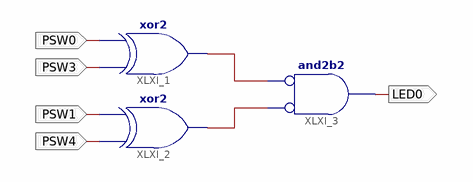
[diagram p0: schematic sheet 1]
// Xilinx ISE schematic lab5_1_comparator.sch (spartan3) as structural Verilog: 3 symbols, 5 ports
module lab5_1_comparator (
  input  PSW0,
  input  PSW3,
  input  PSW1,
  input  PSW4,
  output LED0
);

  wire XLXN_1, XLXN_2;

  xor XLXI_1 (XLXN_1, PSW3, PSW0);
  xor XLXI_2 (XLXN_2, PSW4, PSW1);
  and XLXI_3 (LED0, ~XLXN_2, ~XLXN_1);  // and2b2
endmodule
